# Altium project Nixie.PrjPcb
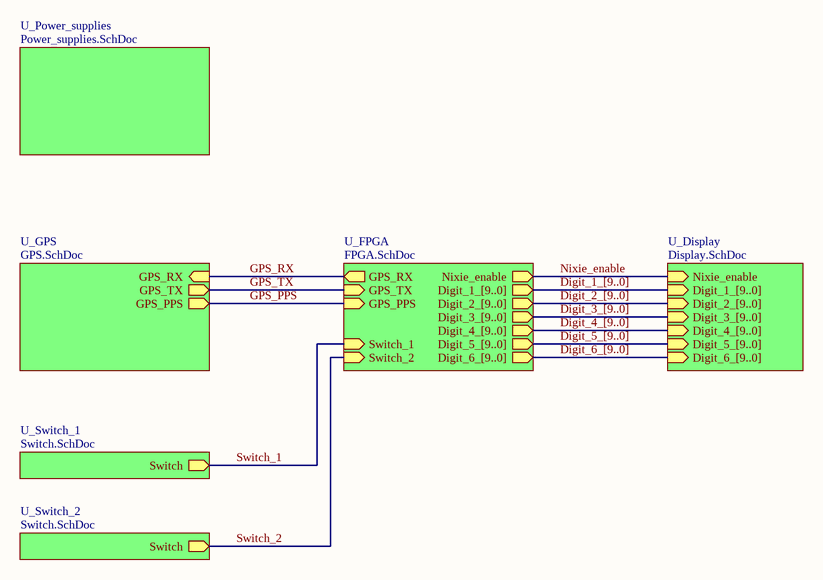
[diagram p0: Nixie_top.SchDoc]
12 sheets, 245 parts. Net scope: hierarchical (ports join the sheet entries above them; power ports are global).
Board file: Nixie.PcbDoc
Sheets:
  Nixie_top.SchDoc
    U_Power_supplies = Power_supplies.SchDoc
      U_HV_supply = HV_supply.SchDoc
      U_LV_supplies = LV_supplies.SchDoc
    U_Display = Display.SchDoc
      U_Digit_1 = Digit.SchDoc
      U_Digit_2 = Digit.SchDoc
      U_Digit_3 = Digit.SchDoc
      U_Digit_4 = Digit.SchDoc
      U_Digit_5 = Digit.SchDoc
      U_Digit_6 = Digit.SchDoc
    U_FPGA = FPGA.SchDoc
      U_FPGA_power = FPGA_power.SchDoc
      U_FPGA_config = FPGA_config.SchDoc
      U_FPGA_IOs = FPGA_IOs.SchDoc
    U_GPS = GPS.SchDoc
    U_Switch_1 = Switch.SchDoc
    U_Switch_2 = Switch.SchDoc

## Sheet Nixie_top.SchDoc: Nixie top level
size A4; Author: L. Sartory; Organization: L. Sartory; Address2: Nixie clock; Address3: with GPS synchronization; DocumentNumber: 1; Revision: B1; SheetNumber: 1; SheetTotal: 12

### Sub-sheets
U_Display = Display.SchDoc: Nixie_enable (in), Digit_1_[9..0] (in), Digit_2_[9..0] (in), Digit_3_[9..0] (in), Digit_4_[9..0] (in), Digit_5_[9..0] (in), Digit_6_[9..0] (in)
U_FPGA = FPGA.SchDoc: Nixie_enable (out), Digit_1_[9..0] (out), Digit_2_[9..0] (out), Digit_3_[9..0] (out), Digit_4_[9..0] (out), Digit_5_[9..0] (out), Digit_6_[9..0] (out), GPS_RX (out), GPS_TX (in), GPS_PPS (in), Switch_2 (in), Switch_1 (in)
U_GPS = GPS.SchDoc: GPS_PPS (out), GPS_TX (out), GPS_RX (in)
U_Power_supplies = Power_supplies.SchDoc: no entries
U_Switch_1 = Switch.SchDoc: Switch (out)
U_Switch_2 = Switch.SchDoc: Switch (out)

### Nets
GPS_PPS: sheet U_FPGA/GPS_PPS, sheet U_GPS/GPS_PPS
GPS_RX: sheet U_FPGA/GPS_RX, sheet U_GPS/GPS_RX
GPS_TX: sheet U_FPGA/GPS_TX, sheet U_GPS/GPS_TX
Nixie_enable: sheet U_Display/Nixie_enable, sheet U_FPGA/Nixie_enable
Switch_1: sheet U_FPGA/Switch_1, sheet U_Switch_1/Switch
Switch_2: sheet U_FPGA/Switch_2, sheet U_Switch_2/Switch

### Buses and harness runs
bus Digit_1_[9..0] = sheet U_Display/Digit_1_[9..0] = sheet U_FPGA/Digit_1_[9..0]
bus Digit_2_[9..0] = sheet U_Display/Digit_2_[9..0] = sheet U_FPGA/Digit_2_[9..0]
bus Digit_3_[9..0] = sheet U_Display/Digit_3_[9..0] = sheet U_FPGA/Digit_3_[9..0]
bus Digit_4_[9..0] = sheet U_Display/Digit_4_[9..0] = sheet U_FPGA/Digit_4_[9..0]
bus Digit_5_[9..0] = sheet U_Display/Digit_5_[9..0] = sheet U_FPGA/Digit_5_[9..0]
bus Digit_6_[9..0] = sheet U_Display/Digit_6_[9..0] = sheet U_FPGA/Digit_6_[9..0]

### Notes on the sheet
- Title
- Size:
- Date:
- A4
- Number:
- Time:
- Revision:
- Sheet
- of
- File:

## Sheet Power_supplies.SchDoc: Power supplies top level
size A4; Author: L. Sartory; Organization: L. Sartory; Address2: Nixie clock; Address3: with GPS synchronization; DocumentNumber: 9; Revision: B1; SheetNumber: 9; SheetTotal: 12
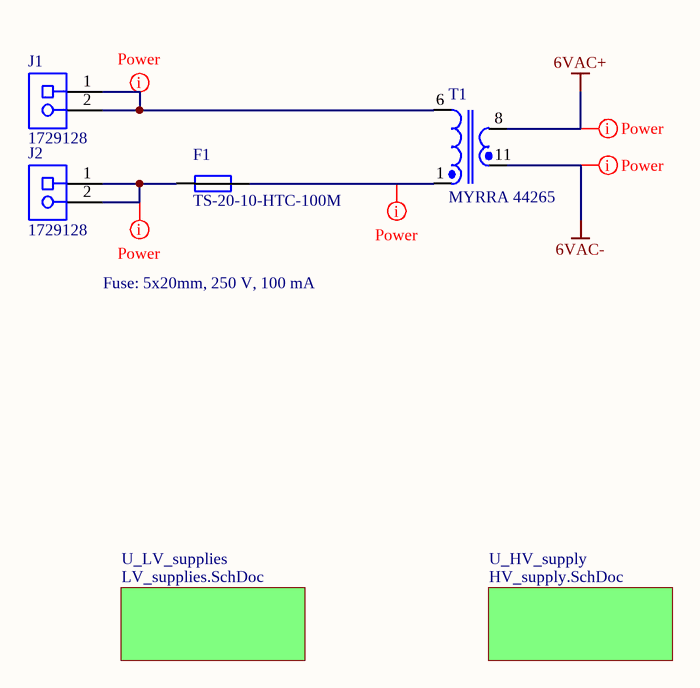
[diagram p1: Power_supplies.SchDoc]

### Parts
F1  TS-20-10-HTC-100M  [TS-20-10-HTC-100M]
J1  1729128  [1729128]
J2  1729128  [1729128]
T1  MYRRA 44265  [MYRRA_44265]

### Sub-sheets
U_HV_supply = HV_supply.SchDoc: no entries
U_LV_supplies = LV_supplies.SchDoc: no entries

### Nets
6VAC+: T1.8
6VAC-: T1.11
NetF1_1: F1.1 J2.1 J2.2
NetF1_2: F1.2 T1.1
NetJ1_1: J1.1 J1.2 T1.6

### Layout directives
net class Power: 6VAC+, 6VAC-, NetF1_1, NetF1_2, NetJ1_1

### Notes on the sheet
- Fuse: 5x20mm, 250 V, 100 mA
- Title
- Size:
- Date:
- A4
- Number:
- Time:
- Revision:
- Sheet
- of
- File:
- (in symbol TS-20-10-HTC-100M) Text

### Library data of the parts
F1 = TS-20-10-HTC-100M: Fuse holder
J1 J2 = 1729128: PCB Terminal Block, 13.5 A, 400 V, 2-Pin THD, RoHS, Bulk; Manufacturer: Phoenix Contact; Package Version: 03/2015; No. of Rows: 1; Pitch: 5.08mm; No. of Positions: 2; Voltage Rating: 400V; Current Rating: 13500mA; Manufacturer URL: http://www.phoenixcontact.com/; Datasheet URL: https://datasheet.ciiva.com/16046/1729128-16046181.pdf; RoHS: TRUE; Package URL: https://www.phoenixcontact.com/online/portal/pi/pxc/product_detail_page/!ut/p/b1/3VdJjqNKFDxLH8AFycySyWY2ozFsEPOMMQaDOX1XedGL_1Vdm5YXJleknhSKeBkvI6EA8ncAo3AYoDhBQGco6KN7VURTdemj9us_IEKEZo_YHiPAEWEFmDGOHMORkqKYCORBZxgL7ZoaZYcbFFUZ3fqxSY6GOuxydWUuHqz1ynmMFygu583Bob0Ewr6Sd_l-5m-kAueHiB0jpRwZwe58wwtkpxtMYd_LmGcDRU02dRNEyWt6Y2ti5pSyJ_reIkzIulrqApdnbT11V5jnCKbYNCvhEM1MCpPByat_X379-iThf08CI5GfOPqfBeS3BRoBOdD55AKVv0iLwCMq-2BrzXWSGRH7pUGD9uwXQjiph3xL0DKQwdGa0JImiIOmBNOestqgwTHSSs2oOep-78apyXQBvNi8ZLaFjvjWvcaUEBu0MC6Wbe-d6mB0FAebo2lUWinqYaZs5DAYzV0RP9yitUjnGJ0iI9xhZkT42OCQNUJJhkgWINNQLP2JFP6OpMg3JCVg70jqHT0lvKOnhHf0lPuOnnLf0VPuWx6_dxwUIvwk5WMkT0kLL1mh61l2yZVSzG3pYV_bqo-mj6uMKwKwdnnW8Jh5RTOJzMOA5c-eJDaZQw4mTMPH02PvS_ZAqNVjVTo2WyYLkwH_KU1mmmG5kjRhDqPXLwwVHvVOjCM60-fpXvTDfMGW1PVFVS1r4e4yVDk4ZdNbkUHvqPqQSeian4UD39fNKmachqdJ1NJbyk8rXT9mXTvPk3oE5meulKGgiruPJek-4I9hTT6G8ZLOyRSm2RRVbThERQad5OS28hdt4YW4vG0stgYYzsWsK4_7y6DZMjJSCqri1kyiZR5vD7pwIrNR7QwPHTcLTI5qT7eRlpHrdGiupYlqQDJ7zy_CND8fWWBoLRXxk1RVcXiBQwbTD4Xi7KL-FuO94t9xaqweXzH; PartNumber: 1729128; Package Description: 2-Pin Through Hole Device, Body 8.1 x 10.16 mm, Pitch 5.08 mm; Datasheet Version: 12/2013; Mounting Technology: ThroughHole; Orientation: Horizontal; Package Reference: 1729128-2; Packing: Bulk
T1 = MYRRA 44265: Isolation Transformer 10 VA, 230V, 6V; HelpURL: https://datasheet.ciiva.com/1377/92210-1377460.pdf

## Sheet HV_supply.SchDoc: High-voltage power supply
size A4; Author: L. Sartory; Organization: L. Sartory; Address2: Nixie clock; Address3: with GPS synchronization; DocumentNumber: 10; Revision: B1; SheetNumber: 10; SheetTotal: 12
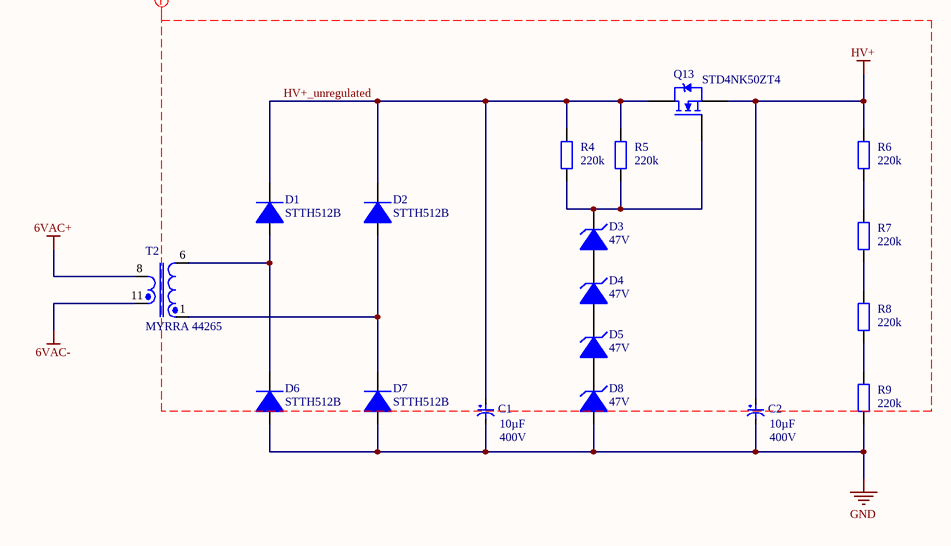
[diagram p2: HV_supply.SchDoc]

### Parts
C1  value 10µF  Voltage: 400V  [EEVEB2G100SM]  (hidden comment: EEVEB2G100SM)
C2  value 10µF  Voltage: 400V  [EEVEB2G100SM]  (hidden comment: EEVEB2G100SM)
D1  STTH512B  [STTH512B]
D2  STTH512B  [STTH512B]
D3  47V  [1SMB5941BT3G]
D4  47V  [1SMB5941BT3G]
D5  47V  [1SMB5941BT3G]
D6  STTH512B  [STTH512B]
D7  STTH512B  [STTH512B]
D8  47V  [1SMB5941BT3G]
Q13  STD4NK50ZT4  [STD4NK50ZT4]
R4  220k  [RES0805]
R5  220k  [RES0805]
R6  220k  [RES0805]
R7  220k  [RES0805]
R8  220k  [RES0805]
R9  220k  [RES0805]
T2  MYRRA 44265  [MYRRA_44265]

### Nets
6VAC+: T2.8
6VAC-: T2.11
GND: C1.2 C2.2 D6.A D7.A D8.A R9.1
HV+: C2.1 Q13.s(S) R6.2
HV+_unregulated: C1.1 D1.K D2.K Q13.D R4.2 R5.2
NetD1_A: D1.A D6.K T2.6
NetD2_A: D2.A D7.K T2.1
NetD3_A: D3.A D4.K
NetD3_K: D3.K Q13.G R4.1 R5.1
NetD4_A: D4.A D5.K
NetD5_A: D5.A D8.K
NetR6_1: R6.1 R7.2
NetR7_1: R7.1 R8.2
NetR8_1: R8.1 R9.2

### Layout directives
net class High_Voltage: HV+, HV+_unregulated

### Notes on the sheet
- Title
- Size:
- Date:
- A4
- Number:
- Time:
- Revision:
- Sheet
- of
- File:
- (in symbol 220k 0805) Text

### Library data of the parts
C1 C2 = EEVEB2G100SM: Aluminum Electrolytic Capacitor, 10µF, 400V; HelpURL: https://datasheet.ciiva.com/17535/aba0000ce11-17535277.pdf
D1 D2 D6 D7 = STTH512B: Ultrafast recovery - 1200 V diode; HelpURL: https://datasheet.ciiva.com/6374/cd00096465-6374991.pdf
D3-D5 D8 = 1SMB5941BT3G: 47V Zener diode; HelpURL: https://datasheet.ciiva.com/15142/getdatasheetpartid-72163-15142395.pdf
Q13 = STD4NK50ZT4: N-CHANNEL 500V - 2.4Ω - 3A DPAK MOSFET; HelpURL: https://datasheet.ciiva.com/4443/cd00003100-79249-4443539.pdf
R4-R9 = 220k 0805: Chip resistor 220k 0805; Value: 220k
T2 = MYRRA 44265: Isolation Transformer 10 VA, 230V, 6V; HelpURL: https://datasheet.ciiva.com/1377/92210-1377460.pdf

## Sheet LV_supplies.SchDoc: Low-voltage power supplies
size A4; Author: L. Sartory; Organization: L. Sartory; Address2: Nixie clock; Address3: with GPS synchronization; DocumentNumber: 11; Revision: B1; SheetNumber: 11; SheetTotal: 12
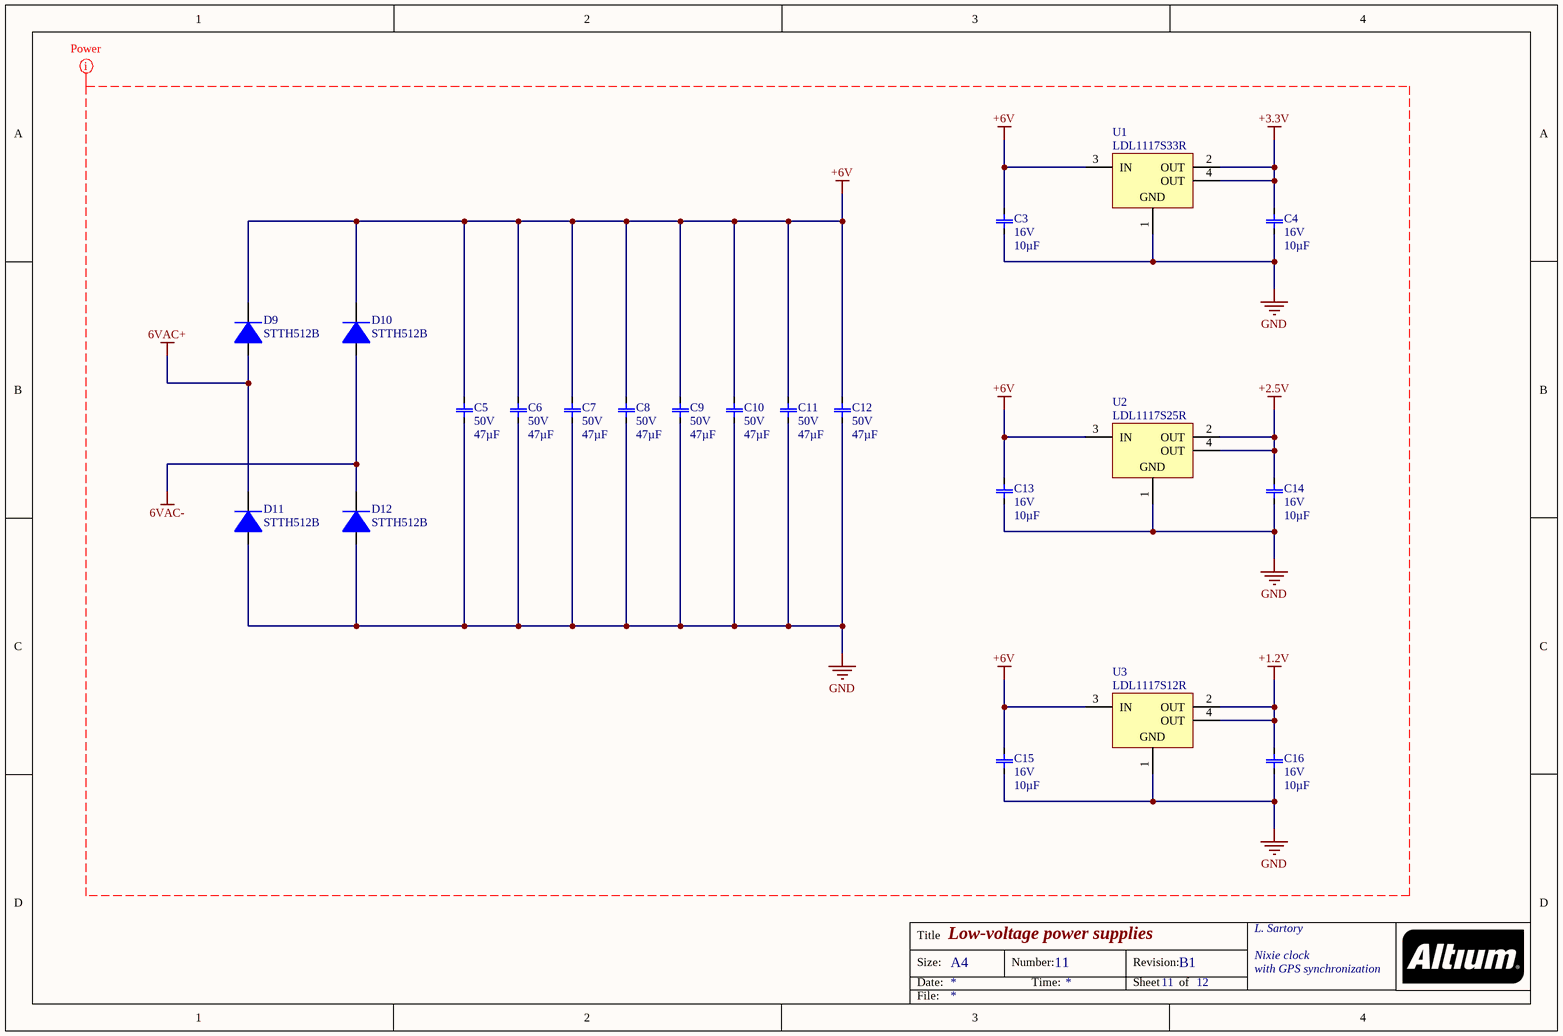
[diagram p3: LV_supplies.SchDoc]

### Parts
C3  Voltage: 16V  [MLCC_1210]  (hidden comment: 10µF)
C4  Voltage: 16V  [MLCC_1210]  (hidden comment: 10µF)
C5  Voltage: 50V  [MLCC_1210]  (hidden comment: 47µF)
C6  Voltage: 50V  [MLCC_1210]  (hidden comment: 47µF)
C7  Voltage: 50V  [MLCC_1210]  (hidden comment: 47µF)
C8  Voltage: 50V  [MLCC_1210]  (hidden comment: 47µF)
C9  Voltage: 50V  [MLCC_1210]  (hidden comment: 47µF)
C10  Voltage: 50V  [MLCC_1210]  (hidden comment: 47µF)
C11  Voltage: 50V  [MLCC_1210]  (hidden comment: 47µF)
C12  Voltage: 50V  [MLCC_1210]  (hidden comment: 47µF)
C13  Voltage: 16V  [MLCC_1210]  (hidden comment: 10µF)
C14  Voltage: 16V  [MLCC_1210]  (hidden comment: 10µF)
C15  Voltage: 16V  [MLCC_1210]  (hidden comment: 10µF)
C16  Voltage: 16V  [MLCC_1210]  (hidden comment: 10µF)
D9  STTH512B  [STTH512B]
D10  STTH512B  [STTH512B]
D11  STTH512B  [STTH512B]
D12  STTH512B  [STTH512B]
U1  LDL1117S33R  [TLV1117]
U2  LDL1117S25R  [TLV1117]
U3  LDL1117S12R  [TLV1117]

### Nets
6VAC+: D9.A D11.K
6VAC-: D10.A D12.K
+1.2V: C16.2 U3.2(OUT) U3.4(OUT)
+2.5V: C14.2 U2.2(OUT) U2.4(OUT)
+3.3V: C4.2 U1.2(OUT) U1.4(OUT)
+6V: C3.2 C5.2 C6.2 C7.2 C8.2 C9.2 C10.2 C11.2 C12.2 C13.2 C15.2 D9.K D10.K U1.3(IN) U2.3(IN) U3.3(IN)
GND: C3.1 C4.1 C5.1 C6.1 C7.1 C8.1 C9.1 C10.1 C11.1 C12.1 C13.1 C14.1 C15.1 C16.1 D11.A D12.A U1.1(GND) U2.1(GND) U3.1(GND)

### Layout directives
net class Power: 6VAC+, 6VAC-, +1.2V, +2.5V, +3.3V, +6V, GND

### Notes on the sheet
- Title
- Size:
- Date:
- A4
- Number:
- Time:
- Revision:
- Sheet
- of
- File:

### Library data of the parts
C3 C4 C13-C16 = MLCC 10µF 16V 1210: Value: 10µF
C5-C12 = MLCC 47µF 50V 1210: Value: 47µF
D9-D12 = STTH512B: Ultrafast recovery - 1200 V diode; HelpURL: https://datasheet.ciiva.com/6374/cd00096465-6374991.pdf
U1 = LDL1117S33R: Fixed LDO Voltage Regulator, 2.6 V to 18 V input, 75 mV Dropout, 3.3 V / 1.2 A out, SOT-223-4; PartNumber: TLV1117LV12DCYT; Manufacturer: Texas Instruments; Fixed Output Options(V): 1.2; Vdo(Typ)(mV): 1200; SubFamily: Single Channel LDO; Vin(Min)(V): 2; Vin(Max)(V): 5.5; Eco-Plan: Green (RoHS & no Sb/Br); Iout(Max)(A): 1; Iq(Typ)(mA): 0.05; PackageVersion: 4202506/B; ComponentLink2URL: http://www.ti.com/general/docs/lit/getliterature.tsp?genericPartNumber=TLV1117LV12&fileType=pdf; ComponentLink2Description: Datasheet; ComponentLink3Description: Package Specification; Vout Adj(Max)(V): 1.2; ComponentLink1Description: Manufacturer URL; DatasheetVersion: SBVS160A; PackageDescription: 4-Pin Plastic Small Outline, Body 3.5 x 6.5 mm, Pitch 2.3 mm; ComponentLink1URL: http://www.ti.com/; PackageReference: DCY0004A; Code_JEDEC: TO-261; Accuracy(%): 2; Mounting Technology: Surface Mount; Vout Adj(Min)(V): 1.2; ComponentLink3URL: http://www.ti.com/litv/pdf/mpds094a
U2 = LDL1117S25R: Fixed LDO Voltage Regulator, 2.6 V to 18 V input, 75 mV Dropout, 2.5 V / 1.2 A out, SOT-223-4; Manufacturer: Texas Instruments; PartNumber: TLV1117LV25DCYT; Fixed Output Options(V): 2.5; Accuracy(%): 2; Iq(Typ)(mA): 0.05; Eco-Plan: Green (RoHS & no Sb/Br); Vdo(Typ)(mV): 1200; Iout(Max)(A): 1; Vin(Max)(V): 5.5; SubFamily: Single Channel LDO; ComponentLink3URL: http://www.ti.com/litv/pdf/mpds094a; DatasheetVersion: SBVS160A; PackageVersion: 4202506/B; Mounting Technology: Surface Mount; PackageDescription: 4-Pin Plastic Small Outline, Body 3.5 x 6.5 mm, Pitch 2.3 mm; ComponentLink2Description: Datasheet; ComponentLink3Description: Package Specification; ComponentLink2URL: http://www.ti.com/general/docs/lit/getliterature.tsp?genericPartNumber=TLV1117LV25&fileType=pdf; Code_JEDEC: TO-261; Vout Adj(Min)(V): 2.5; Vin(Min)(V): 2; PackageReference: DCY0004A; ComponentLink1Description: Manufacturer URL; ComponentLink1URL: http://www.ti.com/; Vout Adj(Max)(V): 2.5
U3 = LDL1117S12R: Fixed LDO Voltage Regulator, 2.6 V to 18 V input, 170 mV Dropout, 1.2 V / 1.2 A out, SOT-223-4; Manufacturer: Texas Instruments; PartNumber: TLV1117LV30DCYT; Vout Adj(Min)(V): 3; Iout(Max)(A): 1; Vin(Max)(V): 5.5; Vdo(Typ)(mV): 1200; Accuracy(%): 2; SubFamily: Single Channel LDO; Iq(Typ)(mA): 0.05; Eco-Plan: Green (RoHS & no Sb/Br); PackageVersion: 4202506/B; ComponentLink2URL: http://www.ti.com/general/docs/lit/getliterature.tsp?genericPartNumber=TLV1117LV30&fileType=pdf; ComponentLink3URL: http://www.ti.com/litv/pdf/mpds094a; ComponentLink3Description: Package Specification; Mounting Technology: Surface Mount; PackageDescription: 4-Pin Plastic Small Outline, Body 3.5 x 6.5 mm, Pitch 2.3 mm; DatasheetVersion: SBVS160A; Fixed Output Options(V): 3; Vin(Min)(V): 2; PackageReference: DCY0004A; Code_JEDEC: TO-261; ComponentLink2Description: Datasheet; ComponentLink1Description: Manufacturer URL; ComponentLink1URL: http://www.ti.com/; Vout Adj(Max)(V): 3

## Sheet Display.SchDoc: Nixe display array
size A4; Author: L. Sartory; Organization: L. Sartory; Address2: Nixie clock; Address3: with GPS synchronization; DocumentNumber: 2; Revision: B1; SheetNumber: 2; SheetTotal: 12
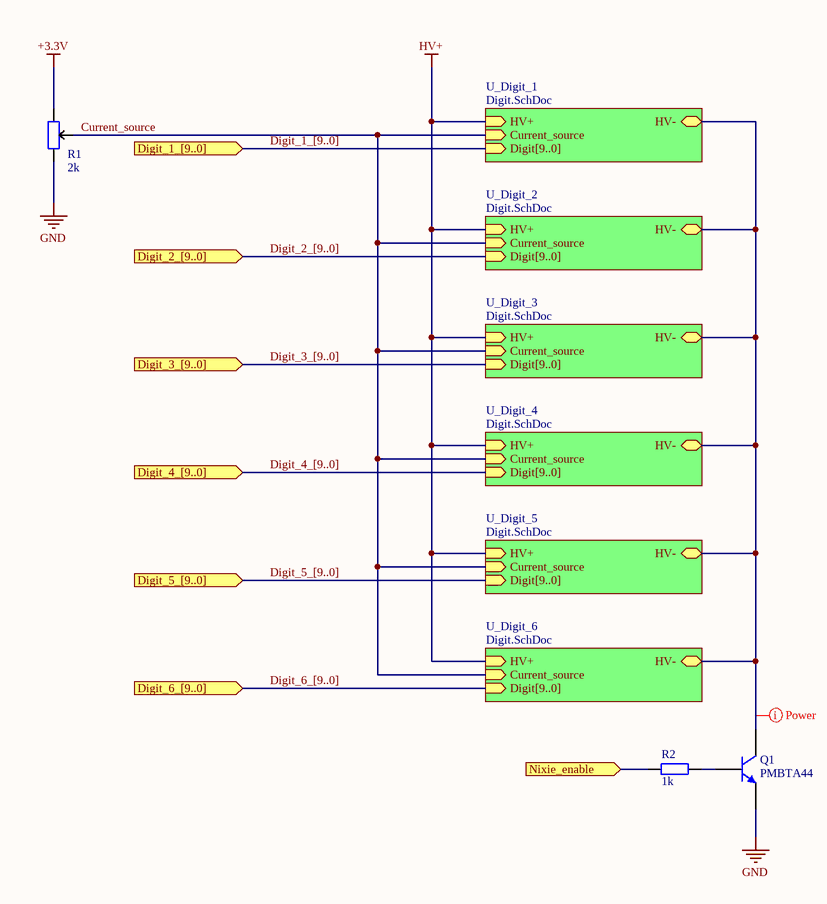
[diagram p4: Display.SchDoc]

### Parts
Q1  PMBTA44  [SOT23_PMBTA44]
R1  2k  [3314G-2-202E]
R2  1k  [RES0805]

### Sub-sheets
U_Digit_1 = Digit.SchDoc: HV+ (in), HV- (bidir), Current_source (in), Digit[9..0] (in)
U_Digit_2 = Digit.SchDoc: HV+ (in), HV- (bidir), Current_source (in), Digit[9..0] (in)
U_Digit_3 = Digit.SchDoc: HV+ (in), HV- (bidir), Current_source (in), Digit[9..0] (in)
U_Digit_4 = Digit.SchDoc: HV+ (in), HV- (bidir), Current_source (in), Digit[9..0] (in)
U_Digit_5 = Digit.SchDoc: HV+ (in), HV- (bidir), Current_source (in), Digit[9..0] (in)
U_Digit_6 = Digit.SchDoc: HV+ (in), HV- (bidir), Current_source (in), Digit[9..0] (in)

### Ports
Digit_1_[9..0] (in), Digit_2_[9..0] (in), Digit_3_[9..0] (in), Digit_4_[9..0] (in), Digit_5_[9..0] (in), Digit_6_[9..0] (in), Nixie_enable (in)

### Nets
+3.3V: R1.1
GND: Q1.2(E) R1.3
HV+: sheet U_Digit_1/HV+, sheet U_Digit_2/HV+, sheet U_Digit_3/HV+, sheet U_Digit_4/HV+, sheet U_Digit_5/HV+, sheet U_Digit_6/HV+
Current_source: R1.2 ; sheet U_Digit_1/Current_source, sheet U_Digit_2/Current_source, sheet U_Digit_3/Current_source, sheet U_Digit_4/Current_source, sheet U_Digit_5/Current_source, sheet U_Digit_6/Current_source
Nixie_enable: R2.1 ; port Nixie_enable
NetQ1_1: Q1.1(B) R2.2
NetQ1_3: Q1.3(C) ; sheet U_Digit_1/HV-, sheet U_Digit_2/HV-, sheet U_Digit_3/HV-, sheet U_Digit_4/HV-, sheet U_Digit_5/HV-, sheet U_Digit_6/HV-

### Buses and harness runs
bus Digit_1_[9..0] = port Digit_1_[9..0] = sheet U_Digit_1/Digit[9..0]
bus Digit_2_[9..0] = port Digit_2_[9..0] = sheet U_Digit_2/Digit[9..0]
bus Digit_3_[9..0] = port Digit_3_[9..0] = sheet U_Digit_3/Digit[9..0]
bus Digit_4_[9..0] = port Digit_4_[9..0] = sheet U_Digit_4/Digit[9..0]
bus Digit_5_[9..0] = port Digit_5_[9..0] = sheet U_Digit_5/Digit[9..0]
bus Digit_6_[9..0] = port Digit_6_[9..0] = sheet U_Digit_6/Digit[9..0]

### Layout directives
net class Power: NetQ1_3

### Notes on the sheet
- Title
- Size:
- Date:
- A4
- Number:
- Time:
- Revision:
- Sheet
- of
- File:
- (in symbol 1k 0805) Text
- (in symbol 3314G-2-202E) Text

### Library data of the parts
Q1 = PMBTA44: 400 V, 0.3 A NPN high-voltage low VCEsat transistor; HelpURL: http://assets.nexperia.com/documents/data-sheet/PMBTA44.pdf
R1 = 3314G-2-202E: Trimming potentiometer, 2k; Value: 2k
R2 = 1k 0805: Chip resistor 1k 0805; Value: 1k

## Sheet Digit.SchDoc: Single Nixie digit
size A4; Author: L. Sartory; Organization: L. Sartory; Address2: Nixie clock; Address3: with GPS synchronization; DocumentNumber: 3; Revision: B1; SheetNumber: 3; SheetTotal: 12
Used 6 times, as channels U_Display/U_Digit_1, U_Display/U_Digit_2, U_Display/U_Digit_3, U_Display/U_Digit_4, U_Display/U_Digit_5, U_Display/U_Digit_6. Parts and nets are listed once, with the designators drawn on the sheet.
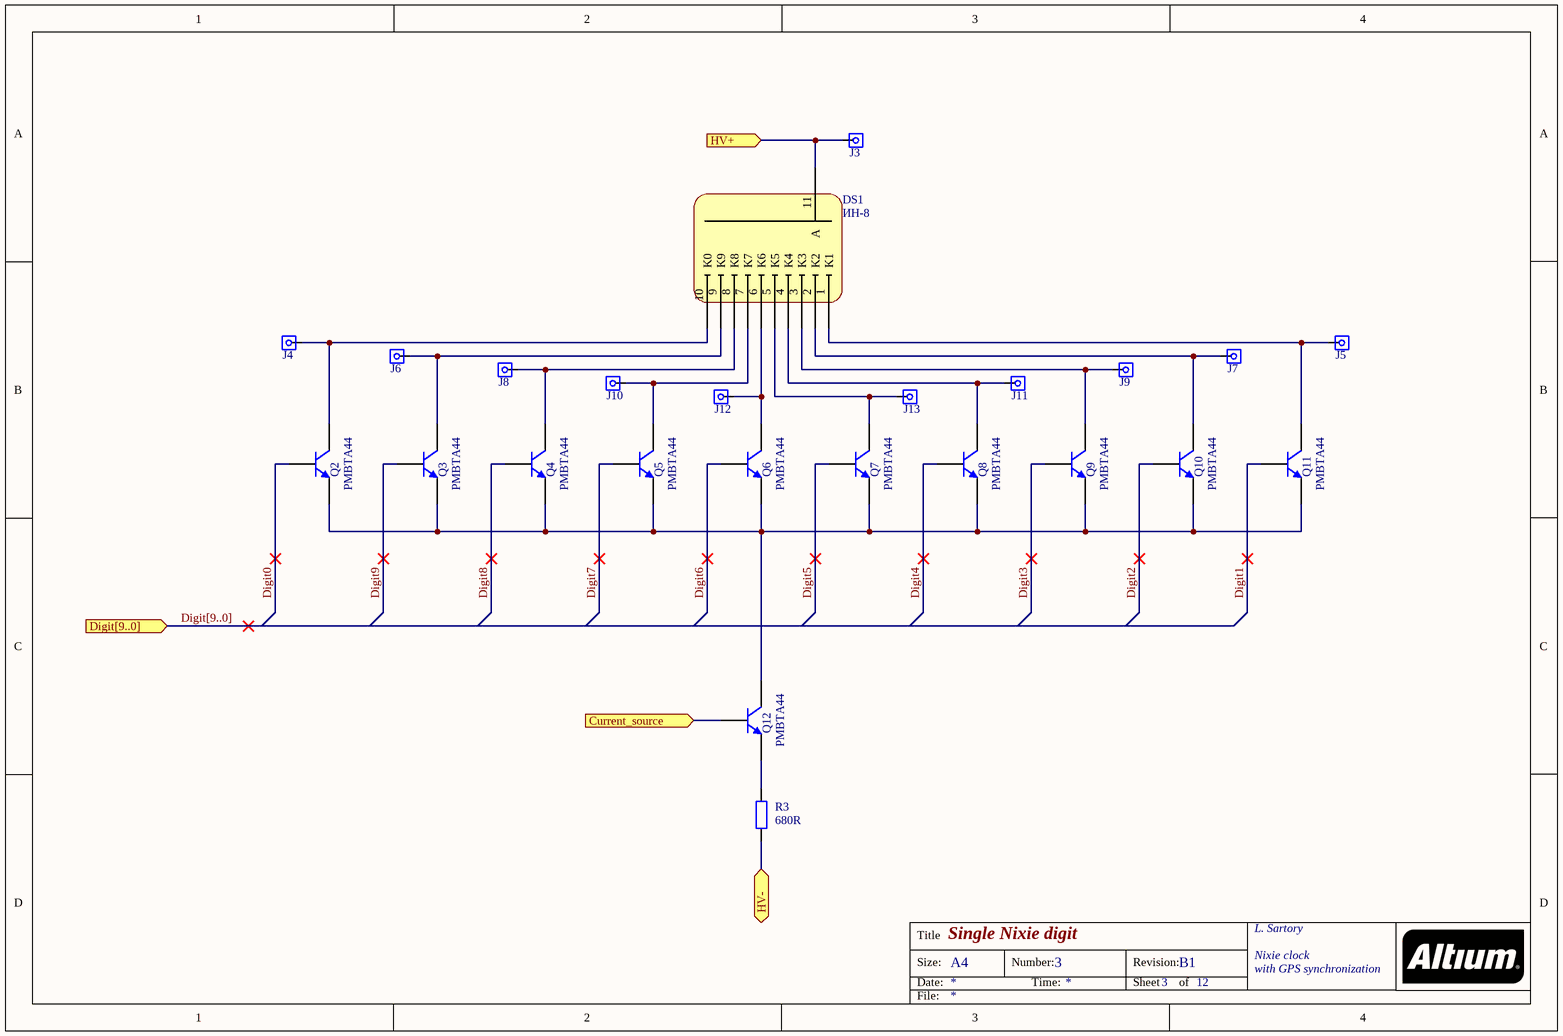
[diagram p5: Digit.SchDoc]

### Parts
DS1  ИН-8  [IN-8]
J3  TE_5645518-1  [TE_5645518-1]  (value not drawn)
J4  TE_5645518-1  [TE_5645518-1]  (value not drawn)
J5  TE_5645518-1  [TE_5645518-1]  (value not drawn)
J6  TE_5645518-1  [TE_5645518-1]  (value not drawn)
J7  TE_5645518-1  [TE_5645518-1]  (value not drawn)
J8  TE_5645518-1  [TE_5645518-1]  (value not drawn)
J9  TE_5645518-1  [TE_5645518-1]  (value not drawn)
J10  TE_5645518-1  [TE_5645518-1]  (value not drawn)
J11  TE_5645518-1  [TE_5645518-1]  (value not drawn)
J12  TE_5645518-1  [TE_5645518-1]  (value not drawn)
J13  TE_5645518-1  [TE_5645518-1]  (value not drawn)
Q2  PMBTA44  [SOT23_PMBTA44]
Q3  PMBTA44  [SOT23_PMBTA44]
Q4  PMBTA44  [SOT23_PMBTA44]
Q5  PMBTA44  [SOT23_PMBTA44]
Q6  PMBTA44  [SOT23_PMBTA44]
Q7  PMBTA44  [SOT23_PMBTA44]
Q8  PMBTA44  [SOT23_PMBTA44]
Q9  PMBTA44  [SOT23_PMBTA44]
Q10  PMBTA44  [SOT23_PMBTA44]
Q11  PMBTA44  [SOT23_PMBTA44]
Q12  PMBTA44  [SOT23_PMBTA44]
R3  680R  [RES0805]

### Ports
Current_source (in), Digit[9..0] (in), HV+ (in), HV- (bidir)

### Nets
Current_source: Q12.1(B) ; port Current_source
Digit0: Q2.1(B)
Digit1: Q11.1(B)
Digit2: Q10.1(B)
Digit3: Q9.1(B)
Digit4: Q8.1(B)
Digit5: Q7.1(B)
Digit6: Q6.1(B)
Digit7: Q5.1(B)
Digit8: Q4.1(B)
Digit9: Q3.1(B)
HV+: DS1.11(A) J3.1 ; port HV+
HV-: R3.1 ; port HV-
NetDS1_1: DS1.1(K1) J5.1 Q11.3(C)
NetDS1_2: DS1.2(K2) J7.1 Q10.3(C)
NetDS1_3: DS1.3(K3) J9.1 Q9.3(C)
NetDS1_4: DS1.4(K4) J11.1 Q8.3(C)
NetDS1_5: DS1.5(K5) J13.1 Q7.3(C)
NetDS1_6: DS1.6(K6) J12.1 Q6.3(C)
NetDS1_7: DS1.7(K7) J10.1 Q5.3(C)
NetDS1_8: DS1.8(K8) J8.1 Q4.3(C)
NetDS1_9: DS1.9(K9) J6.1 Q3.3(C)
NetDS1_10: DS1.10(K0) J4.1 Q2.3(C)
NetQ2_2: Q2.2(E) Q3.2(E) Q4.2(E) Q5.2(E) Q6.2(E) Q7.2(E) Q8.2(E) Q9.2(E) Q10.2(E) Q11.2(E) Q12.3(C)
NetQ12_2: Q12.2(E) R3.2

### Channels
U_Display/U_Digit_1: designators end in _1; ports Current_source=Current_source HV+=HV+ HV-=NetQ1_3
U_Display/U_Digit_2: designators end in _2; ports Current_source=Current_source HV+=HV+ HV-=NetQ1_3
U_Display/U_Digit_3: designators end in _3; ports Current_source=Current_source HV+=HV+ HV-=NetQ1_3
U_Display/U_Digit_4: designators end in _4; ports Current_source=Current_source HV+=HV+ HV-=NetQ1_3
U_Display/U_Digit_5: designators end in _5; ports Current_source=Current_source HV+=HV+ HV-=NetQ1_3
U_Display/U_Digit_6: designators end in _6; ports Current_source=Current_source HV+=HV+ HV-=NetQ1_3

### Buses and harness runs
bus Digit[9..0] = port Digit[9..0]

### Notes on the sheet
- Title
- Size:
- Date:
- A4
- Number:
- Time:
- Revision:
- Sheet
- of
- File:
- (in symbol 680R 0805) Text

### Library data of the parts
DS1 = ИН-8: Nixie tube
J3-J13 = TE_5645518-1: Mini-spring socket
Q2-Q12 = PMBTA44: as Q1 on sheet Display; HelpURL: http://assets.nexperia.com/documents/data-sheet/PMBTA44.pdf
R3 = 680R 0805: Chip resistor 680R 0805; Value: 680R

## Sheet FPGA.SchDoc: FPGA top level
size A4; Author: L. Sartory; Organization: L. Sartory; Address2: Nixie clock; Address3: with GPS synchronization; DocumentNumber: 4; Revision: B1; SheetNumber: 4; SheetTotal: 12
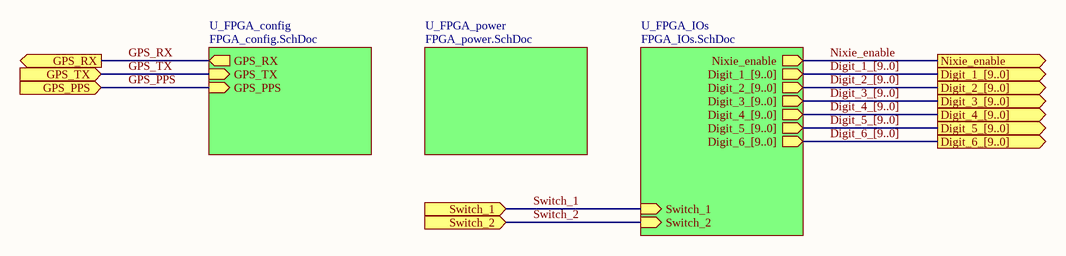
[diagram p6: FPGA.SchDoc]

### Sub-sheets
U_FPGA_config = FPGA_config.SchDoc: GPS_TX (in), GPS_RX (out), GPS_PPS (in)
U_FPGA_IOs = FPGA_IOs.SchDoc: Nixie_enable (out), Digit_1_[9..0] (out), Digit_2_[9..0] (out), Digit_3_[9..0] (out), Digit_4_[9..0] (out), Digit_5_[9..0] (out), Digit_6_[9..0] (out), Switch_2 (in), Switch_1 (in)
U_FPGA_power = FPGA_power.SchDoc: no entries

### Ports
Digit_1_[9..0] (out), Digit_2_[9..0] (out), Digit_3_[9..0] (out), Digit_4_[9..0] (out), Digit_5_[9..0] (out), Digit_6_[9..0] (out), GPS_PPS (in), GPS_RX (out), GPS_TX (in), Nixie_enable (out), Switch_1 (in), Switch_2 (in)

### Nets
GPS_PPS: port GPS_PPS, sheet U_FPGA_config/GPS_PPS
GPS_RX: port GPS_RX, sheet U_FPGA_config/GPS_RX
GPS_TX: port GPS_TX, sheet U_FPGA_config/GPS_TX
Nixie_enable: port Nixie_enable, sheet U_FPGA_IOs/Nixie_enable
Switch_1: port Switch_1, sheet U_FPGA_IOs/Switch_1
Switch_2: port Switch_2, sheet U_FPGA_IOs/Switch_2

### Buses and harness runs
bus Digit_1_[9..0] = port Digit_1_[9..0] = sheet U_FPGA_IOs/Digit_1_[9..0]
bus Digit_2_[9..0] = port Digit_2_[9..0] = sheet U_FPGA_IOs/Digit_2_[9..0]
bus Digit_3_[9..0] = port Digit_3_[9..0] = sheet U_FPGA_IOs/Digit_3_[9..0]
bus Digit_4_[9..0] = port Digit_4_[9..0] = sheet U_FPGA_IOs/Digit_4_[9..0]
bus Digit_5_[9..0] = port Digit_5_[9..0] = sheet U_FPGA_IOs/Digit_5_[9..0]
bus Digit_6_[9..0] = port Digit_6_[9..0] = sheet U_FPGA_IOs/Digit_6_[9..0]

### Notes on the sheet
- Title
- Size:
- Date:
- A4
- Number:
- Time:
- Revision:
- Sheet
- of
- File:

## Sheet FPGA_power.SchDoc: FPGA power supply
size A4; Author: L. Sartory; Organization: L. Sartory; Address2: Nixie clock; Address3: with GPS synchronization; DocumentNumber: 7; Revision: B1; SheetNumber: 7; SheetTotal: 12
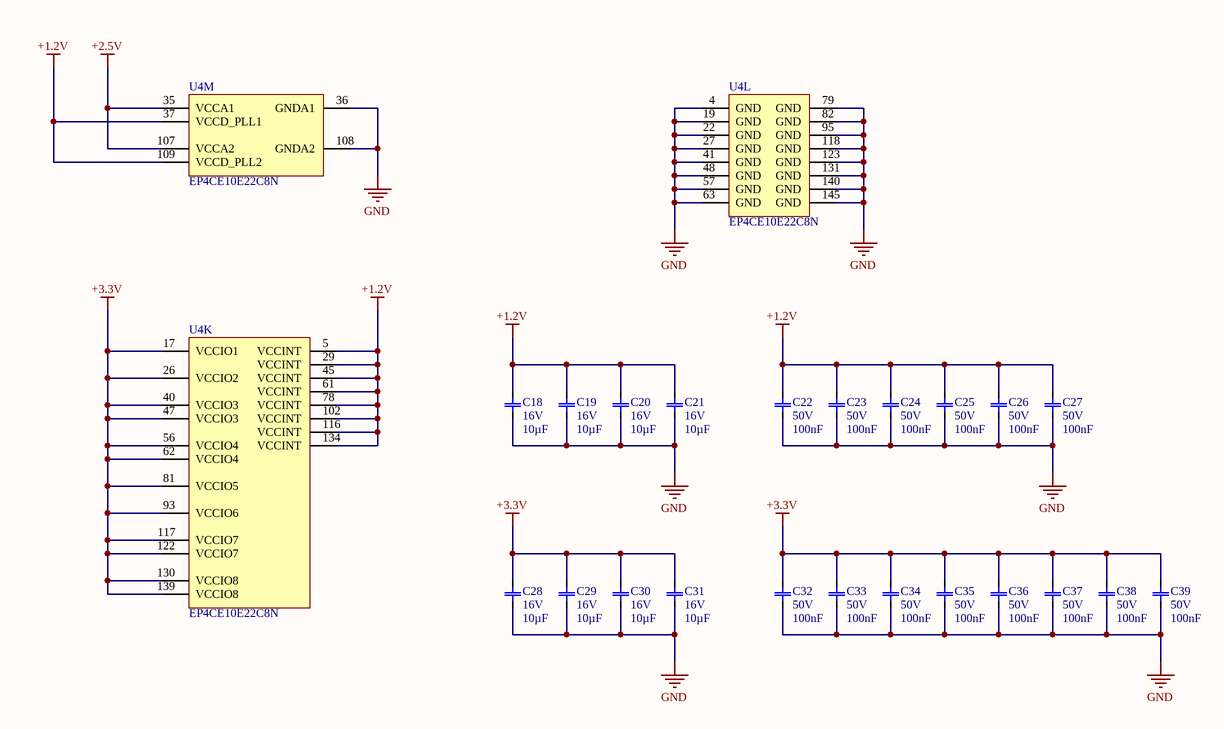
[diagram p7: FPGA_power.SchDoc]

### Parts
C18  Voltage: 16V  [MLCC_1210]  (hidden comment: 10µF)
C19  Voltage: 16V  [MLCC_1210]  (hidden comment: 10µF)
C20  Voltage: 16V  [MLCC_1210]  (hidden comment: 10µF)
C21  Voltage: 16V  [MLCC_1210]  (hidden comment: 10µF)
C22  Voltage: 50V  [MLCC_0603]  (hidden comment: 100nF)
C23  Voltage: 50V  [MLCC_0603]  (hidden comment: 100nF)
C24  Voltage: 50V  [MLCC_0603]  (hidden comment: 100nF)
C25  Voltage: 50V  [MLCC_0603]  (hidden comment: 100nF)
C26  Voltage: 50V  [MLCC_0603]  (hidden comment: 100nF)
C27  Voltage: 50V  [MLCC_0603]  (hidden comment: 100nF)
C28  Voltage: 16V  [MLCC_1210]  (hidden comment: 10µF)
C29  Voltage: 16V  [MLCC_1210]  (hidden comment: 10µF)
C30  Voltage: 16V  [MLCC_1210]  (hidden comment: 10µF)
C31  Voltage: 16V  [MLCC_1210]  (hidden comment: 10µF)
C32  Voltage: 50V  [MLCC_0603]  (hidden comment: 100nF)
C33  Voltage: 50V  [MLCC_0603]  (hidden comment: 100nF)
C34  Voltage: 50V  [MLCC_0603]  (hidden comment: 100nF)
C35  Voltage: 50V  [MLCC_0603]  (hidden comment: 100nF)
C36  Voltage: 50V  [MLCC_0603]  (hidden comment: 100nF)
C37  Voltage: 50V  [MLCC_0603]  (hidden comment: 100nF)
C38  Voltage: 50V  [MLCC_0603]  (hidden comment: 100nF)
C39  Voltage: 50V  [MLCC_0603]  (hidden comment: 100nF)
U4  EP4CE10E22C8N  [EP4CE10E22C8N]  (parts K,L,M of 13)

### Nets
+1.2V: C18.2 C19.2 C20.2 C21.2 C22.2 C23.2 C24.2 C25.2 C26.2 C27.2 U4.5(VCCINT) U4.29(VCCINT) U4.37(VCCD_PLL1) U4.45(VCCINT) U4.61(VCCINT) U4.78(VCCINT) U4.102(VCCINT) U4.109(VCCD_PLL2) U4.116(VCCINT) U4.134(VCCINT)
+2.5V: U4.35(VCCA1) U4.107(VCCA2)
+3.3V: C28.2 C29.2 C30.2 C31.2 C32.2 C33.2 C34.2 C35.2 C36.2 C37.2 C38.2 C39.2 U4.17(VCCIO1) U4.26(VCCIO2) U4.40(VCCIO3) U4.47(VCCIO3) U4.56(VCCIO4) U4.62(VCCIO4) U4.81(VCCIO5) U4.93(VCCIO6) U4.117(VCCIO7) U4.122(VCCIO7) U4.130(VCCIO8) U4.139(VCCIO8)
GND: C18.1 C19.1 C20.1 C21.1 C22.1 C23.1 C24.1 C25.1 C26.1 C27.1 C28.1 C29.1 C30.1 C31.1 C32.1 C33.1 C34.1 C35.1 C36.1 C37.1 C38.1 C39.1 U4.4(GND) U4.19(GND) U4.22(GND) U4.27(GND) U4.36(GNDA1) U4.41(GND) U4.48(GND) U4.57(GND) U4.63(GND) U4.79(GND) U4.82(GND) U4.95(GND) U4.108(GNDA2) U4.118(GND) U4.123(GND) U4.131(GND) U4.140(GND) U4.145(GND)

### Notes on the sheet
- Title
- Size:
- Date:
- A4
- Number:
- Time:
- Revision:
- Sheet
- of
- File:

### Library data of the parts
C18-C21 C28-C31 = MLCC 10µF 16V 1210: Value: 10µF
C22-C27 C32-C39 = MLCC 100nF 50V 0603: Value: 100nF
U4 = EP4CE10E22C8N: Cyclone IV Family FPGA, 1.2V Core, 91 I/O Pins, 2 PLLs, 144-Pin QFP, Speed Grade 8, Commercial Grade, Pb-Free; Manufacturer: Altera; PackageDescription: 144-Pin Plastic Enhanced Quad Flat Pack (EQFP) - Wire Bond - A:1.65 - D2:5.4; ComponentLink2Description: Handbook; DatasheetVersion: ver1.6, Nov-2011; ComponentLink2URL: http://www.altera.com/literature/hb/cyclone-iv/cyclone4-handbook.pdf; PackageVersion: ver1.0, Jan-2011; ComponentLink1URL: http://www.altera.com/; ComponentLink3Description: Pinout; ComponentLink4Description: Package Specification; PackageReference: EQFP144_A-165_D2-54; Code_JEDEC: MS-026-BFB-HD; ComponentLink3URL: http://www.altera.com/literature/lit-dp.jsp?category=cyc%204&showspreadsheet=y; ComponentLink1Description: Manufacturer URL; ComponentLink4URL: http://www.altera.com/devicepackaging/04R00402-00.pdf

## Sheet FPGA_config.SchDoc: FPGA configuration
size A4; Author: L. Sartory; Organization: L. Sartory; Address2: Nixie clock; Address3: with GPS synchronization; DocumentNumber: 5; Revision: B1; SheetNumber: 5; SheetTotal: 12
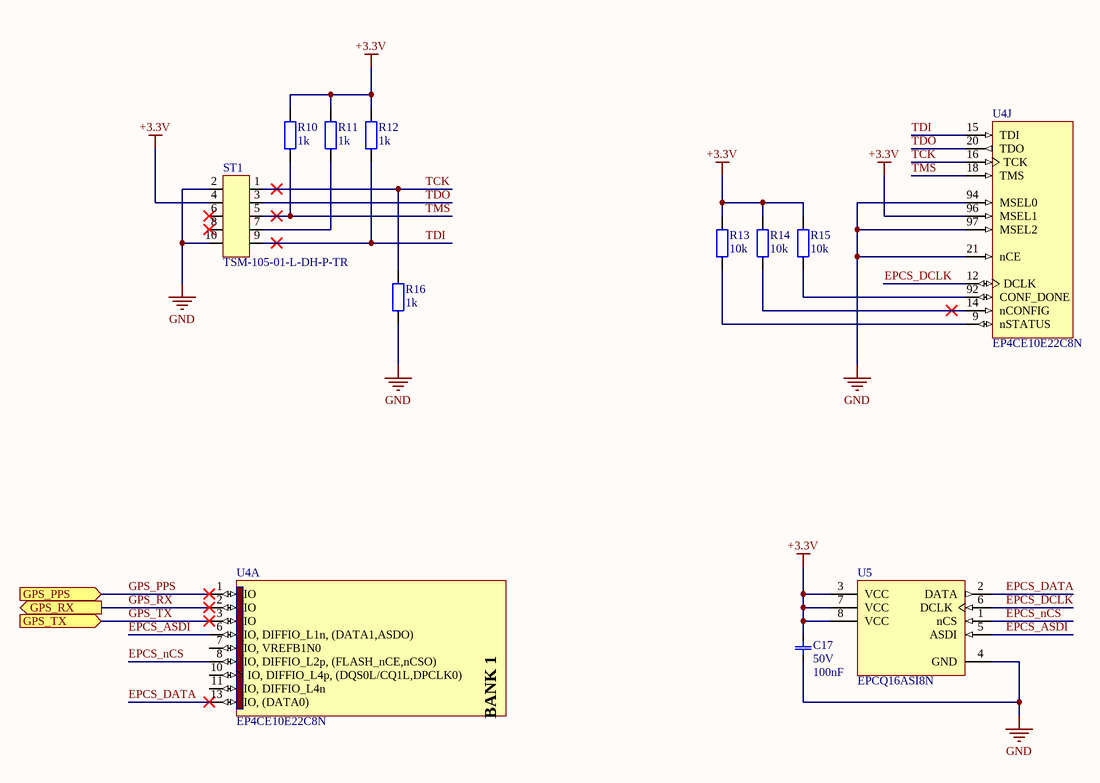
[diagram p8: FPGA_config.SchDoc]

### Parts
C17  Voltage: 50V  [MLCC_0603]  (hidden comment: 100nF)
R10  1k  [RES0805]
R11  1k  [RES0805]
R12  1k  [RES0805]
R13  10k  [RES0805]
R14  10k  [RES0805]
R15  10k  [RES0805]
R16  1k  [RES0805]
ST1  TSM-105-01-L-DH-P-TR  [TSM-105-01-L-DH-P-TR]
U4  EP4CE10E22C8N  [EP4CE10E22C8N]  (parts A,J of 13)
U5  EPCQ16ASI8N  [EPCQ16ASI8N]

### Ports
GPS_PPS (in), GPS_RX (out), GPS_TX (in)

### Nets
+3.3V: C17.2 R10.2 R11.2 R12.2 R13.2 R14.2 R15.2 ST1.4 U4.96(MSEL1) U5.3(VCC) U5.7(VCC) U5.8(VCC)
GND: C17.1 R16.1 ST1.2 ST1.10 U4.21(nCE) U4.94(MSEL0) U4.97(MSEL2) U5.4(GND)
EPCS_ASDI: U4.6(IO,_DIFFIO_L1n,_(DATA1,ASDO)) U5.5(ASDI)
EPCS_DATA: U4.13(IO,_(DATA0)) U5.2(DATA)
EPCS_DCLK: U4.12(DCLK) U5.6(DCLK)
EPCS_nCS: U4.8(IO,_DIFFIO_L2p,_(FLASH_nCE,nCSO)) U5.1(nCS)
GPS_PPS: U4.1(IO) ; port GPS_PPS
GPS_RX: U4.2(IO) ; port GPS_RX
GPS_TX: U4.3(IO) ; port GPS_TX
TCK: R16.2 ST1.1 U4.16(TCK)
TDI: R12.1 ST1.9 U4.15(TDI)
TDO: ST1.3 U4.20(TDO)
TMS: R10.1 ST1.5 U4.18(TMS)
NetR11_1: R11.1 ST1.7
NetR13_1: R13.1 U4.9(nSTATUS)
NetR14_1: R14.1 U4.14(nCONFIG)
NetR15_1: R15.1 U4.92(CONF_DONE)

Not connected (* = marked no-connect by the designer): ST1 6* 8*; U4 7(IO,_VREFB1N0) 10(IO,_DIFFIO_L4p,_(DQS0L/CQ1L,DPCLK0)) 11(IO,_DIFFIO_L4n)

### Notes on the sheet
- Title
- Size:
- Date:
- A4
- Number:
- Time:
- Revision:
- Sheet
- of
- File:
- (in symbol 1k 0805) Text
- (in symbol 10k 0805) Text
- (in symbol EP4CE10E22C8N, part A) BANK 1

### Library data of the parts
C17 = MLCC 100nF 50V 0603: Value: 100nF
R10-R12 R16 = 1k 0805: Chip resistor 1k 0805; Value: 1k
R13-R15 = 10k 0805: Chip resistor 10k 0805; Value: 10k
ST1 = TSM-105-01-L-DH-P-TR: Male Connector, 2x5 pins, 2.54 mm, right angle; Angle: 90; Columns: 2; Contacts: 10; Mounting_Technology: SMD; Pitch: 2,54mm; Rated_Current: 4,7A; Rated_Voltage: 475V; Rows: 5; Subtype: Header; Temperature_Max: -55°C; Temperature_Min: 125°C; AccessRights: 2147483647; ContentType: Component; Folder: 02_Component_Classes\01_Connectors\; ItemHRID: CON-00013; RevisionId: A2; Gender: Male; Height: 6,1mm; Part_Number: TSM-105-01-L-DH-P; RoHS: Yes; A2000_Part_Number: 06.02.0061; ComponentType: Connector; ContentTypeGUID: CB3C11C4-E317-11DF-B822-12313F0024A2; FolderGUID: 5495AD52-6690-435F-9E49-44D2F6351017; ItemGUID: 027ABF0C-CE72-4FE2-A6FC-FEB3307CCD0E; LifeCycle: In Prototype; LifeCycleStateGUID: F6472DB9-40C4-4028-BB05-F9D9E28A4AB8; ReleaseDate: 29/03/2017 03:00:55 PM
U4 = EP4CE10E22C8N: as U4 on sheet FPGA_power; PackageDescription: 144-Pin Plastic Enhanced Quad Flat Pack (EQFP) - Wire Bond - A:1.65 - D2:5.4; ComponentLink2Description: Handbook; DatasheetVersion: ver1.6, Nov-2011; ComponentLink2URL: http://www.altera.com/literature/hb/cyclone-iv/cyclone4-handbook.pdf; PackageVersion: ver1.0, Jan-2011; ComponentLink1URL: http://www.altera.com/; ComponentLink3Description: Pinout; ComponentLink4Description: Package Specification; PackageReference: EQFP144_A-165_D2-54; Code_JEDEC: MS-026-BFB-HD; ComponentLink3URL: http://www.altera.com/literature/lit-dp.jsp?category=cyc%204&showspreadsheet=y; ComponentLink1Description: Manufacturer URL; ComponentLink4URL: http://www.altera.com/devicepackaging/04R00402-00.pdf
U5 = EPCQ16ASI8N: EPCS16 Series, In-system programmable 3.3V serial configuration device, 8-Pin SOIC, 16-Megabit, Industrial Grade, Pb-Free; Configures: All Arria series, all Cyclone series and all Stratix series (except Stratix); Code_JEDEC: MS-012-AA; PackageVersion: ver14.2, Oct-2005; PackageReference: SOIC8; Code_IPC: SOIC127P600-8; PackageDescription: 8-Pin Small Outline Integrated Circuit Package (SOIC8); DatasheetVersion: ver3.0, Dec-2009

## Sheet FPGA_IOs.SchDoc: FPGA I/Os
size A4; Author: L. Sartory; Organization: L. Sartory; Address2: Nixie clock; Address3: with GPS synchronization; DocumentNumber: 6; Revision: B1; SheetNumber: 6; SheetTotal: 12
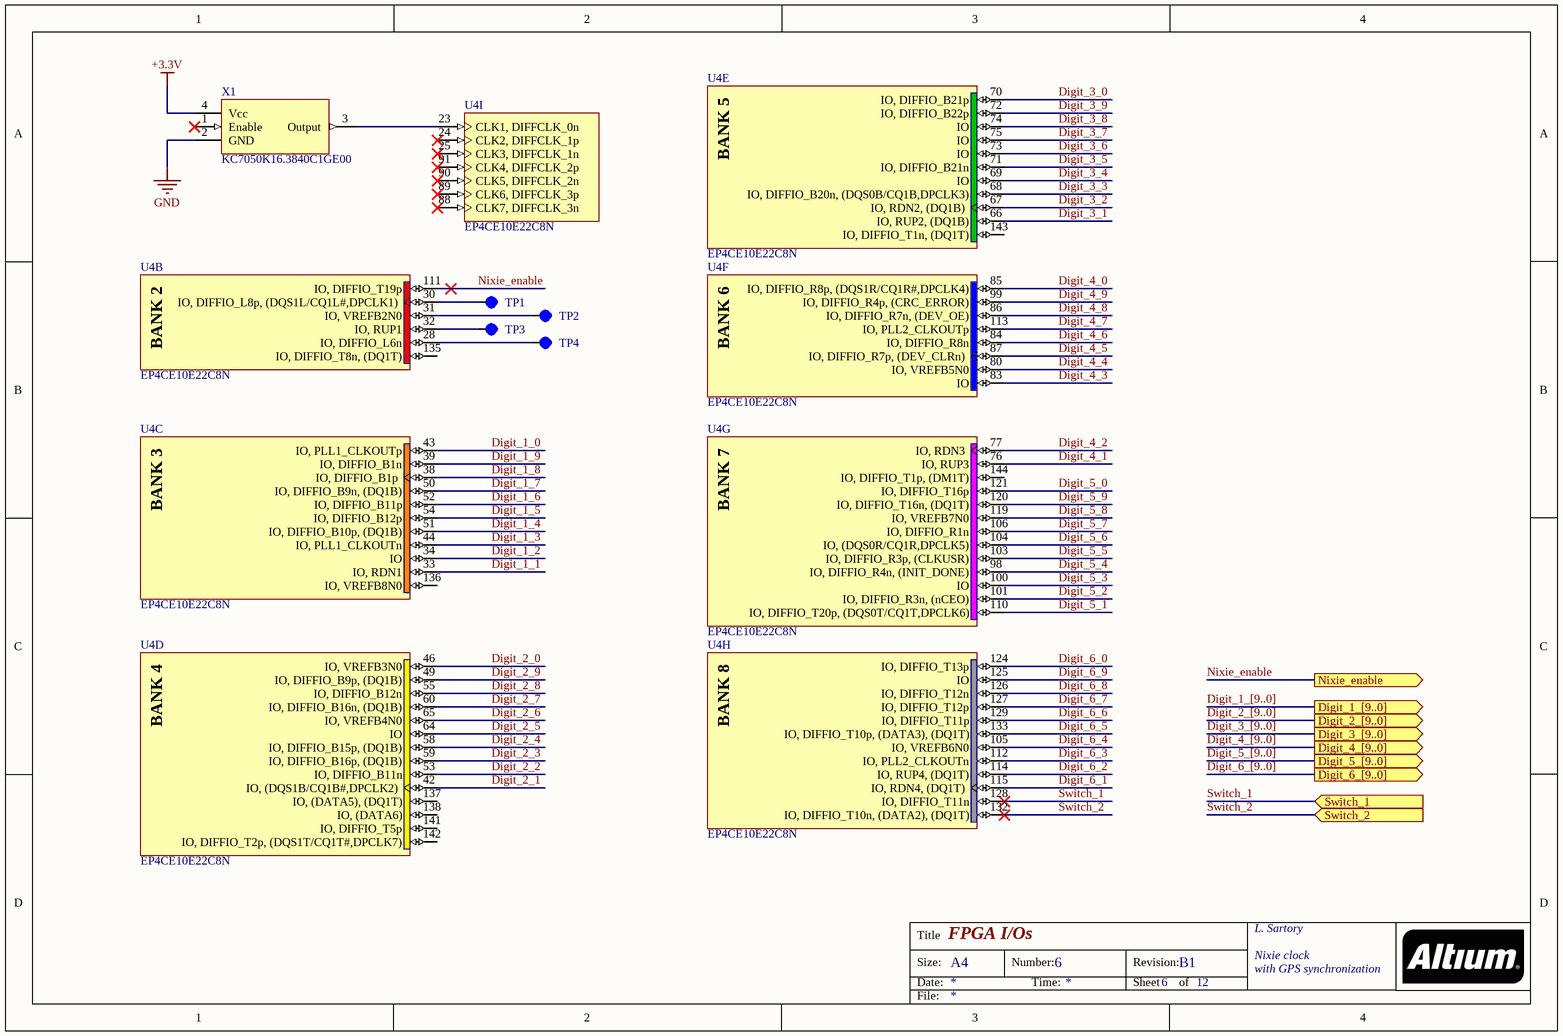
[diagram p9: FPGA_IOs.SchDoc]

### Parts
TP1  Test_point_1mm  [TEST_POINT_1MM]  (value not drawn)  (no BOM)
TP2  Test_point_1mm  [TEST_POINT_1MM]  (value not drawn)  (no BOM)
TP3  Test_point_1mm  [TEST_POINT_1MM]  (value not drawn)  (no BOM)
TP4  Test_point_1mm  [TEST_POINT_1MM]  (value not drawn)  (no BOM)
U4  EP4CE10E22C8N  [EP4CE10E22C8N]  (parts B,C,D,E,F,G,H,I of 13)
X1  KC7050K16.3840C1GE00  [KC7050K16.3840C1GE00]

### Ports
Digit_1_[9..0] (out), Digit_2_[9..0] (out), Digit_3_[9..0] (out), Digit_4_[9..0] (out), Digit_5_[9..0] (out), Digit_6_[9..0] (out), Nixie_enable (out), Switch_1 (in), Switch_2 (in)

### Nets
+3.3V: X1.4(Vcc)
GND: X1.2(GND)
Digit_1_0: U4.43(IO,_PLL1_CLKOUTp)
Digit_1_1: U4.33(IO,_RDN1)
Digit_1_2: U4.34(IO)
Digit_1_3: U4.44(IO,_PLL1_CLKOUTn)
Digit_1_4: U4.51(IO,_DIFFIO_B10p,_(DQ1B))
Digit_1_5: U4.54(IO,_DIFFIO_B12p)
Digit_1_6: U4.52(IO,_DIFFIO_B11p)
Digit_1_7: U4.50(IO,_DIFFIO_B9n,_(DQ1B))
Digit_1_8: U4.38(IO,_DIFFIO_B1p)
Digit_1_9: U4.39(IO,_DIFFIO_B1n)
Digit_2_0: U4.46(IO,_VREFB3N0)
Digit_2_1: U4.42(IO,_(DQS1B/CQ1B#,DPCLK2))
Digit_2_2: U4.53(IO,_DIFFIO_B11n)
Digit_2_3: U4.59(IO,_DIFFIO_B16p,_(DQ1B))
Digit_2_4: U4.58(IO,_DIFFIO_B15p,_(DQ1B))
Digit_2_5: U4.64(IO)
Digit_2_6: U4.65(IO,_VREFB4N0)
Digit_2_7: U4.60(IO,_DIFFIO_B16n,_(DQ1B))
Digit_2_8: U4.55(IO,_DIFFIO_B12n)
Digit_2_9: U4.49(IO,_DIFFIO_B9p,_(DQ1B))
Digit_3_0: U4.70(IO,_DIFFIO_B21p)
Digit_3_1: U4.66(IO,_RUP2,_(DQ1B))
Digit_3_2: U4.67(IO,_RDN2,_(DQ1B))
Digit_3_3: U4.68(IO,_DIFFIO_B20n,_(DQS0B/CQ1B,DPCLK3))
Digit_3_4: U4.69(IO)
Digit_3_5: U4.71(IO,_DIFFIO_B21n)
Digit_3_6: U4.73(IO)
Digit_3_7: U4.75(IO)
Digit_3_8: U4.74(IO)
Digit_3_9: U4.72(IO,_DIFFIO_B22p)
Digit_4_0: U4.85(IO,_DIFFIO_R8p,_(DQS1R/CQ1R#,DPCLK4))
Digit_4_1: U4.76(IO,_RUP3)
Digit_4_2: U4.77(IO,_RDN3)
Digit_4_3: U4.83(IO)
Digit_4_4: U4.80(IO,_VREFB5N0)
Digit_4_5: U4.87(IO,_DIFFIO_R7p,_(DEV_CLRn))
Digit_4_6: U4.84(IO,_DIFFIO_R8n)
Digit_4_7: U4.113(IO,_PLL2_CLKOUTp)
Digit_4_8: U4.86(IO,_DIFFIO_R7n,_(DEV_OE))
Digit_4_9: U4.99(IO,_DIFFIO_R4p,_(CRC_ERROR))
Digit_5_0: U4.121(IO,_DIFFIO_T16p)
Digit_5_1: U4.110(IO,_DIFFIO_T20p,_(DQS0T/CQ1T,DPCLK6))
Digit_5_2: U4.101(IO,_DIFFIO_R3n,_(nCEO))
Digit_5_3: U4.100(IO)
Digit_5_4: U4.98(IO,_DIFFIO_R4n,_(INIT_DONE))
Digit_5_5: U4.103(IO,_DIFFIO_R3p,_(CLKUSR))
Digit_5_6: U4.104(IO,_(DQS0R/CQ1R,DPCLK5))
Digit_5_7: U4.106(IO,_DIFFIO_R1n)
Digit_5_8: U4.119(IO,_VREFB7N0)
Digit_5_9: U4.120(IO,_DIFFIO_T16n,_(DQ1T))
Digit_6_0: U4.124(IO,_DIFFIO_T13p)
Digit_6_1: U4.115(IO,_RDN4,_(DQ1T))
Digit_6_2: U4.114(IO,_RUP4,_(DQ1T))
Digit_6_3: U4.112(IO,_PLL2_CLKOUTn)
Digit_6_4: U4.105(IO,_VREFB6N0)
Digit_6_5: U4.133(IO,_DIFFIO_T10p,_(DATA3),_(DQ1T))
Digit_6_6: U4.129(IO,_DIFFIO_T11p)
Digit_6_7: U4.127(IO,_DIFFIO_T12p)
Digit_6_8: U4.126(IO,_DIFFIO_T12n)
Digit_6_9: U4.125(IO)
Nixie_enable: U4.111(IO,_DIFFIO_T19p) ; port Nixie_enable
Switch_1: U4.128(IO,_DIFFIO_T11n) ; port Switch_1
Switch_2: U4.132(IO,_DIFFIO_T10n,_(DATA2),_(DQ1T)) ; port Switch_2
NetTP1_TP: TP1.TP U4.30(IO,_DIFFIO_L8p,_(DQS1L/CQ1L#,DPCLK1))
NetTP2_TP: TP2.TP U4.31(IO,_VREFB2N0)
NetTP3_TP: TP3.TP U4.32(IO,_RUP1)
NetTP4_TP: TP4.TP U4.28(IO,_DIFFIO_L6n)
NetU4_23: U4.23(CLK1,_DIFFCLK_0n) X1.3(Output)

Not connected (* = marked no-connect by the designer): U4 24(CLK2,_DIFFCLK_1p)* 25(CLK3,_DIFFCLK_1n)* 88(CLK7,_DIFFCLK_3n)* 89(CLK6,_DIFFCLK_3p)* 90(CLK5,_DIFFCLK_2n)* 91(CLK4,_DIFFCLK_2p)* 135(IO,_DIFFIO_T8n,_(DQ1T)) 136(IO,_VREFB8N0) 137(IO,_(DATA5),_(DQ1T)) 138(IO,_(DATA6)) 141(IO,_DIFFIO_T5p) 142(IO,_DIFFIO_T2p,_(DQS1T/CQ1T#,DPCLK7)) 143(IO,_DIFFIO_T1n,_(DQ1T)) 144(IO,_DIFFIO_T1p,_(DM1T)); X1 1(Enable)*

### Buses and harness runs
bus Digit_1_[9..0] = port Digit_1_[9..0]
bus Digit_2_[9..0] = port Digit_2_[9..0]
bus Digit_3_[9..0] = port Digit_3_[9..0]
bus Digit_4_[9..0] = port Digit_4_[9..0]
bus Digit_5_[9..0] = port Digit_5_[9..0]
bus Digit_6_[9..0] = port Digit_6_[9..0]

### Notes on the sheet
- Title
- Size:
- Date:
- A4
- Number:
- Time:
- Revision:
- Sheet
- of
- File:
- (in symbol EP4CE10E22C8N, part B) BANK 2
- (in symbol EP4CE10E22C8N, part C) BANK 3
- (in symbol EP4CE10E22C8N, part D) BANK 4
- (in symbol EP4CE10E22C8N, part E) BANK 5
- (in symbol EP4CE10E22C8N, part F) BANK 6
- (in symbol EP4CE10E22C8N, part G) BANK 7
- (in symbol EP4CE10E22C8N, part H) BANK 8

### Library data of the parts
TP1-TP4 = Test_point_1mm: 1mm test point
U4 = EP4CE10E22C8N: as U4 on sheet FPGA_power; PackageDescription: 144-Pin Plastic Enhanced Quad Flat Pack (EQFP) - Wire Bond - A:1.65 - D2:5.4; ComponentLink2Description: Handbook; DatasheetVersion: ver1.6, Nov-2011; ComponentLink2URL: http://www.altera.com/literature/hb/cyclone-iv/cyclone4-handbook.pdf; PackageVersion: ver1.0, Jan-2011; ComponentLink1URL: http://www.altera.com/; ComponentLink3Description: Pinout; ComponentLink4Description: Package Specification; PackageReference: EQFP144_A-165_D2-54; Code_JEDEC: MS-026-BFB-HD; ComponentLink3URL: http://www.altera.com/literature/lit-dp.jsp?category=cyc%204&showspreadsheet=y; ComponentLink1Description: Manufacturer URL; ComponentLink4URL: http://www.altera.com/devicepackaging/04R00402-00.pdf
X1 = KC7050K16.3840C1GE00: Clock Oscillator, 16.384 MHz, 7x5mm

## Sheet GPS.SchDoc: GPS module
size A4; Author: L. Sartory; Organization: L. Sartory; Address2: Nixie clock; Address3: with GPS synchronization; DocumentNumber: 8; Revision: B1; SheetNumber: 8; SheetTotal: 12
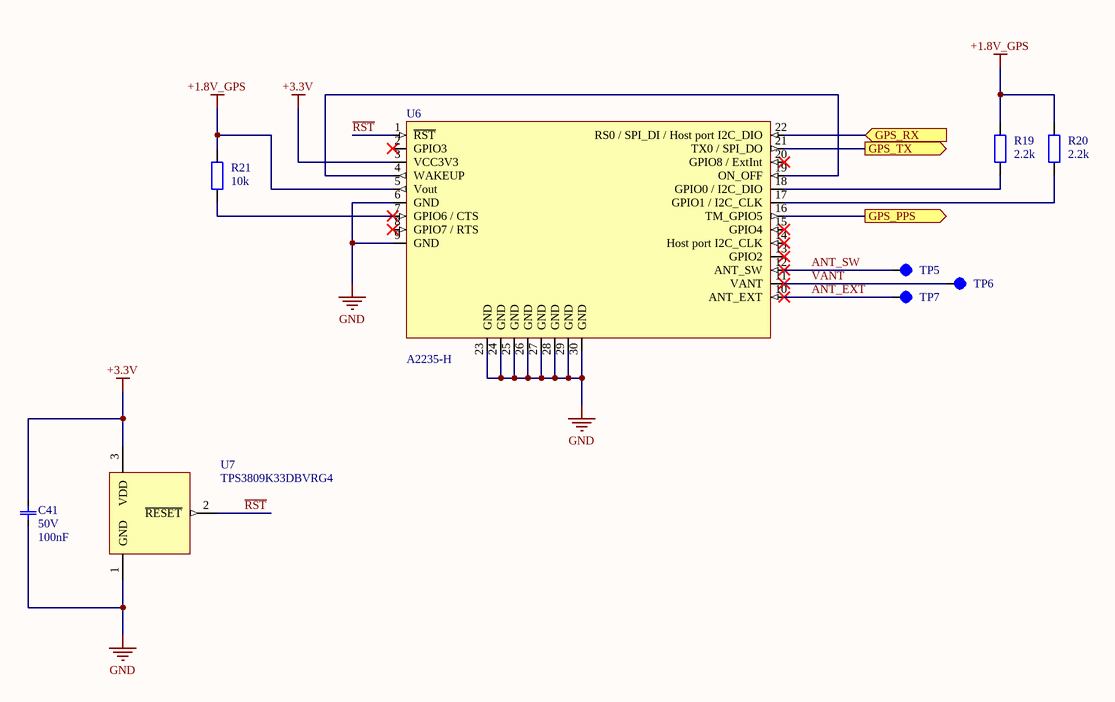
[diagram p10: GPS.SchDoc]

### Parts
C41  Voltage: 50V  [MLCC_0603]  (hidden comment: 100nF)
R19  2.2k  [RES0805]
R20  2.2k  [RES0805]
R21  10k  [RES0805]
TP5  Test_point_1mm  [TEST_POINT_1MM]  (value not drawn)  (no BOM)
TP6  Test_point_1mm  [TEST_POINT_1MM]  (value not drawn)  (no BOM)
TP7  Test_point_1mm  [TEST_POINT_1MM]  (value not drawn)  (no BOM)
U6  A2235-H  [A2235]
U7  TPS3809K33DBVRG4  [TPS3809K33DBVRG4]

### Ports
GPS_PPS (out), GPS_RX (in), GPS_TX (out)

### Nets
+1.8V_GPS: R19.2 R20.2 R21.2 U6.5(Vout)
+3.3V: C41.2 U6.3(VCC3V3) U7.3(VDD)
GND: C41.1 U6.6(GND) U6.9(GND) U6.23(GND) U6.24(GND) U6.25(GND) U6.26(GND) U6.27(GND) U6.28(GND) U6.29(GND) U6.30(GND) U7.1(GND)
ANT_EXT: TP7.TP U6.10(ANT_EXT)
ANT_SW: TP5.TP U6.12(ANT_SW)
GPS_PPS: U6.16(TM_GPIO5) ; port GPS_PPS
GPS_RX: U6.22(RS0_/_SPI_DI_/_Host_port_I2C_DIO) ; port GPS_RX
GPS_TX: U6.21(TX0_/_SPI_DO) ; port GPS_TX
~{RST}: U6.1(~{RST}) U7.2(~{RESET})
VANT: TP6.TP U6.11(VANT)
NetR19_1: R19.1 U6.18(GPIO0_/_I2C_DIO)
NetR20_1: R20.1 U6.17(GPIO1_/_I2C_CLK)
NetR21_1: R21.1 U6.7(GPIO6_/_CTS)
NetU6_4: U6.4(WAKEUP) U6.19(ON_OFF)

Not connected (* = marked no-connect by the designer): U6 2(GPIO3)* 8(GPIO7_/_RTS)* 13(GPIO2)* 14(Host_port_I2C_CLK)* 15(GPIO4)* 20(GPIO8_/_ExtInt)*

### Notes on the sheet
- Title
- Size:
- Date:
- A4
- Number:
- Time:
- Revision:
- Sheet
- of
- File:
- (in symbol 2.2k 0805) Text
- (in symbol 10k 0805) Text

### Library data of the parts
C41 = MLCC 100nF 50V 0603: Value: 100nF
R19 R20 = 2.2k 0805: Chip resistor 2.2k 0805; Value: 2.2k
R21 = 10k 0805: Chip resistor 10k 0805; Value: 10k
TP5-TP7 = Test_point_1mm: 1mm test point
U6 = A2235-H: GPS module
U7 = TPS3809K33DBVRG4: 3.3V supervisor

## Sheet Switch.SchDoc: Debounced switch
size A4; Author: L. Sartory; Organization: L. Sartory; Address2: Nixie clock; Address3: with GPS synchronization; DocumentNumber: 12; Revision: B1; SheetNumber: 12; SheetTotal: 12
Used 2 times, as channels U_Switch_1, U_Switch_2. Parts and nets are listed once, with the designators drawn on the sheet.
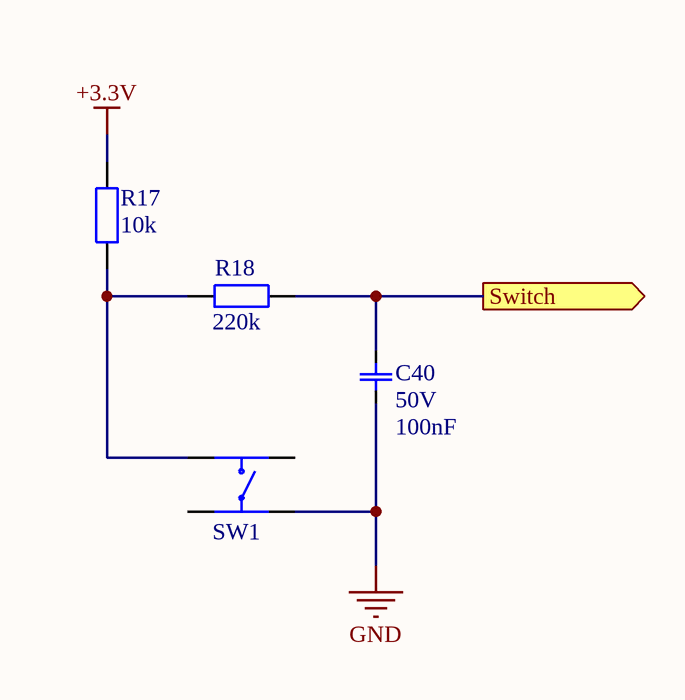
[diagram p11: Switch.SchDoc]

### Parts
C40  Voltage: 50V  [MLCC_0603]  (hidden comment: 100nF)
R17  10k  [RES0805]
R18  220k  [RES0805]
SW1  KSEK43GLFS  [KSEK43GLFS]  (value not drawn)

### Ports
Switch (out)

### Nets
+3.3V: R17.2
GND: C40.2 SW1.3
Switch: C40.1 R18.2 ; port Switch
NetR17_1: R17.1 R18.1 SW1.1

Not connected (* = marked no-connect by the designer): SW1 2 4

### Channels
U_Switch_1: designators end in _1; ports Switch=Switch_1
U_Switch_2: designators end in _2; ports Switch=Switch_2

### Notes on the sheet
- Title
- Size:
- Date:
- A4
- Number:
- Time:
- Revision:
- Sheet
- of
- File:
- (in symbol 10k 0805) Text
- (in symbol 220k 0805) Text

### Library data of the parts
C40 = MLCC 100nF 50V 0603: Value: 100nF
R17 = 10k 0805: Chip resistor 10k 0805; Value: 10k
R18 = 220k 0805: Chip resistor 220k 0805; Value: 220k
SW1 = KSEK43GLFS: Low Profile Tact Switch, 4.3 mm height

## Nets that join several sheets
6VAC+: Power_supplies (T1.8), HV_supply (T2.8), LV_supplies (D9.A D11.K)
6VAC-: Power_supplies (T1.11), HV_supply (T2.11), LV_supplies (D10.A D12.K)
+1.2V: LV_supplies (C16.2 U3.2 U3.4), FPGA_power (20 pins)
+2.5V: LV_supplies (C14.2 U2.2 U2.4), FPGA_power (U4.35 U4.107)
+3.3V: LV_supplies (C4.2 U1.2 U1.4), Display (R1.1), FPGA_power (24 pins), FPGA_config (12 pins), FPGA_IOs (X1.4), GPS (C41.2 U6.3 U7.3), U_Switch_1 (R17_1.2), U_Switch_2 (R17_2.2)
GND: HV_supply (6 pins), LV_supplies (19 pins), Display (Q1.2 R1.3), FPGA_power (40 pins), FPGA_config (8 pins), FPGA_IOs (X1.2), GPS (12 pins), U_Switch_1 (C40_1.2 SW1_1.3), U_Switch_2 (C40_2.2 SW1_2.3)
HV+: HV_supply (C2.1 Q13.s R6.2), U_Display/U_Digit_1 (DS1_1.11 J3_1.1), U_Display/U_Digit_2 (DS1_2.11 J3_2.1), U_Display/U_Digit_3 (DS1_3.11 J3_3.1), U_Display/U_Digit_4 (DS1_4.11 J3_4.1), U_Display/U_Digit_5 (DS1_5.11 J3_5.1), U_Display/U_Digit_6 (DS1_6.11 J3_6.1)
Current_source: Display (R1.2), U_Display/U_Digit_1 (Q12_1.1), U_Display/U_Digit_2 (Q12_2.1), U_Display/U_Digit_3 (Q12_3.1), U_Display/U_Digit_4 (Q12_4.1), U_Display/U_Digit_5 (Q12_5.1), U_Display/U_Digit_6 (Q12_6.1)
Digit_1_0: U_Display/U_Digit_1 (Q2_1.1), FPGA_IOs (U4.43)
Digit_1_1: U_Display/U_Digit_1 (Q11_1.1), FPGA_IOs (U4.33)
Digit_1_2: U_Display/U_Digit_1 (Q10_1.1), FPGA_IOs (U4.34)
Digit_1_3: U_Display/U_Digit_1 (Q9_1.1), FPGA_IOs (U4.44)
Digit_1_4: U_Display/U_Digit_1 (Q8_1.1), FPGA_IOs (U4.51)
Digit_1_5: U_Display/U_Digit_1 (Q7_1.1), FPGA_IOs (U4.54)
Digit_1_6: U_Display/U_Digit_1 (Q6_1.1), FPGA_IOs (U4.52)
Digit_1_7: U_Display/U_Digit_1 (Q5_1.1), FPGA_IOs (U4.50)
Digit_1_8: U_Display/U_Digit_1 (Q4_1.1), FPGA_IOs (U4.38)
Digit_1_9: U_Display/U_Digit_1 (Q3_1.1), FPGA_IOs (U4.39)
Digit_2_0: U_Display/U_Digit_2 (Q2_2.1), FPGA_IOs (U4.46)
Digit_2_1: U_Display/U_Digit_2 (Q11_2.1), FPGA_IOs (U4.42)
Digit_2_2: U_Display/U_Digit_2 (Q10_2.1), FPGA_IOs (U4.53)
Digit_2_3: U_Display/U_Digit_2 (Q9_2.1), FPGA_IOs (U4.59)
Digit_2_4: U_Display/U_Digit_2 (Q8_2.1), FPGA_IOs (U4.58)
Digit_2_5: U_Display/U_Digit_2 (Q7_2.1), FPGA_IOs (U4.64)
Digit_2_6: U_Display/U_Digit_2 (Q6_2.1), FPGA_IOs (U4.65)
Digit_2_7: U_Display/U_Digit_2 (Q5_2.1), FPGA_IOs (U4.60)
Digit_2_8: U_Display/U_Digit_2 (Q4_2.1), FPGA_IOs (U4.55)
Digit_2_9: U_Display/U_Digit_2 (Q3_2.1), FPGA_IOs (U4.49)
Digit_3_0: U_Display/U_Digit_3 (Q2_3.1), FPGA_IOs (U4.70)
Digit_3_1: U_Display/U_Digit_3 (Q11_3.1), FPGA_IOs (U4.66)
Digit_3_2: U_Display/U_Digit_3 (Q10_3.1), FPGA_IOs (U4.67)
Digit_3_3: U_Display/U_Digit_3 (Q9_3.1), FPGA_IOs (U4.68)
Digit_3_4: U_Display/U_Digit_3 (Q8_3.1), FPGA_IOs (U4.69)
Digit_3_5: U_Display/U_Digit_3 (Q7_3.1), FPGA_IOs (U4.71)
Digit_3_6: U_Display/U_Digit_3 (Q6_3.1), FPGA_IOs (U4.73)
Digit_3_7: U_Display/U_Digit_3 (Q5_3.1), FPGA_IOs (U4.75)
Digit_3_8: U_Display/U_Digit_3 (Q4_3.1), FPGA_IOs (U4.74)
Digit_3_9: U_Display/U_Digit_3 (Q3_3.1), FPGA_IOs (U4.72)
Digit_4_0: U_Display/U_Digit_4 (Q2_4.1), FPGA_IOs (U4.85)
Digit_4_1: U_Display/U_Digit_4 (Q11_4.1), FPGA_IOs (U4.76)
Digit_4_2: U_Display/U_Digit_4 (Q10_4.1), FPGA_IOs (U4.77)
Digit_4_3: U_Display/U_Digit_4 (Q9_4.1), FPGA_IOs (U4.83)
Digit_4_4: U_Display/U_Digit_4 (Q8_4.1), FPGA_IOs (U4.80)
Digit_4_5: U_Display/U_Digit_4 (Q7_4.1), FPGA_IOs (U4.87)
Digit_4_6: U_Display/U_Digit_4 (Q6_4.1), FPGA_IOs (U4.84)
Digit_4_7: U_Display/U_Digit_4 (Q5_4.1), FPGA_IOs (U4.113)
Digit_4_8: U_Display/U_Digit_4 (Q4_4.1), FPGA_IOs (U4.86)
Digit_4_9: U_Display/U_Digit_4 (Q3_4.1), FPGA_IOs (U4.99)
Digit_5_0: U_Display/U_Digit_5 (Q2_5.1), FPGA_IOs (U4.121)
Digit_5_1: U_Display/U_Digit_5 (Q11_5.1), FPGA_IOs (U4.110)
Digit_5_2: U_Display/U_Digit_5 (Q10_5.1), FPGA_IOs (U4.101)
Digit_5_3: U_Display/U_Digit_5 (Q9_5.1), FPGA_IOs (U4.100)
Digit_5_4: U_Display/U_Digit_5 (Q8_5.1), FPGA_IOs (U4.98)
Digit_5_5: U_Display/U_Digit_5 (Q7_5.1), FPGA_IOs (U4.103)
Digit_5_6: U_Display/U_Digit_5 (Q6_5.1), FPGA_IOs (U4.104)
Digit_5_7: U_Display/U_Digit_5 (Q5_5.1), FPGA_IOs (U4.106)
Digit_5_8: U_Display/U_Digit_5 (Q4_5.1), FPGA_IOs (U4.119)
Digit_5_9: U_Display/U_Digit_5 (Q3_5.1), FPGA_IOs (U4.120)
Digit_6_0: U_Display/U_Digit_6 (Q2_6.1), FPGA_IOs (U4.124)
Digit_6_1: U_Display/U_Digit_6 (Q11_6.1), FPGA_IOs (U4.115)
Digit_6_2: U_Display/U_Digit_6 (Q10_6.1), FPGA_IOs (U4.114)
Digit_6_3: U_Display/U_Digit_6 (Q9_6.1), FPGA_IOs (U4.112)
Digit_6_4: U_Display/U_Digit_6 (Q8_6.1), FPGA_IOs (U4.105)
Digit_6_5: U_Display/U_Digit_6 (Q7_6.1), FPGA_IOs (U4.133)
Digit_6_6: U_Display/U_Digit_6 (Q6_6.1), FPGA_IOs (U4.129)
Digit_6_7: U_Display/U_Digit_6 (Q5_6.1), FPGA_IOs (U4.127)
Digit_6_8: U_Display/U_Digit_6 (Q4_6.1), FPGA_IOs (U4.126)
Digit_6_9: U_Display/U_Digit_6 (Q3_6.1), FPGA_IOs (U4.125)
GPS_PPS: FPGA_config (U4.1), GPS (U6.16)
GPS_RX: FPGA_config (U4.2), GPS (U6.22)
GPS_TX: FPGA_config (U4.3), GPS (U6.21)
NetQ1_3: Display (Q1.3), U_Display/U_Digit_1 (R3_1.1), U_Display/U_Digit_2 (R3_2.1), U_Display/U_Digit_3 (R3_3.1), U_Display/U_Digit_4 (R3_4.1), U_Display/U_Digit_5 (R3_5.1), U_Display/U_Digit_6 (R3_6.1)
Nixie_enable: Display (R2.1), FPGA_IOs (U4.111)
Switch_1: FPGA_IOs (U4.128), U_Switch_1 (C40_1.1 R18_1.2)
Switch_2: FPGA_IOs (U4.132), U_Switch_2 (C40_2.1 R18_2.2)

## Assembly variants
Without tubes: not fitted DS1_1 DS1_2 DS1_3 DS1_4 DS1_5 DS1_6